# EAGLE design can_split (EAGLE 5.10)
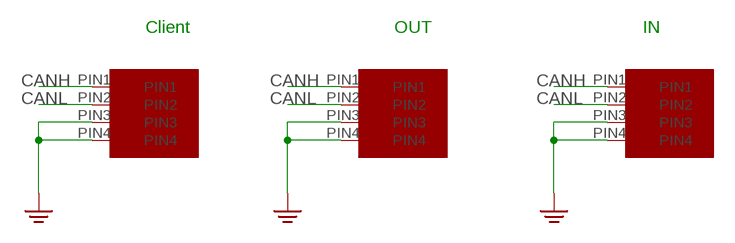
[diagram p0: schematic, sheet 1]

## Parts
U$1  MICROFIT4  [MICROFIT4SOCK]
U$3  MICROFIT4  [MICROFIT4SOCK]
U$4  MICROFIT4  [MICROFIT4SOCK]

## Nets
CANH: U$1.PIN1 U$3.PIN1 U$4.PIN1
CANL: U$1.PIN2 U$3.PIN2 U$4.PIN2
PE: U$1.PIN3 U$1.PIN4 U$3.PIN3 U$3.PIN4 U$4.PIN3 U$4.PIN4

## Notes on the sheet
- Client | OUT | IN

## Library data of the parts
U$1 U$3 U$4 = UNICORN:MICROFIT4

## Board
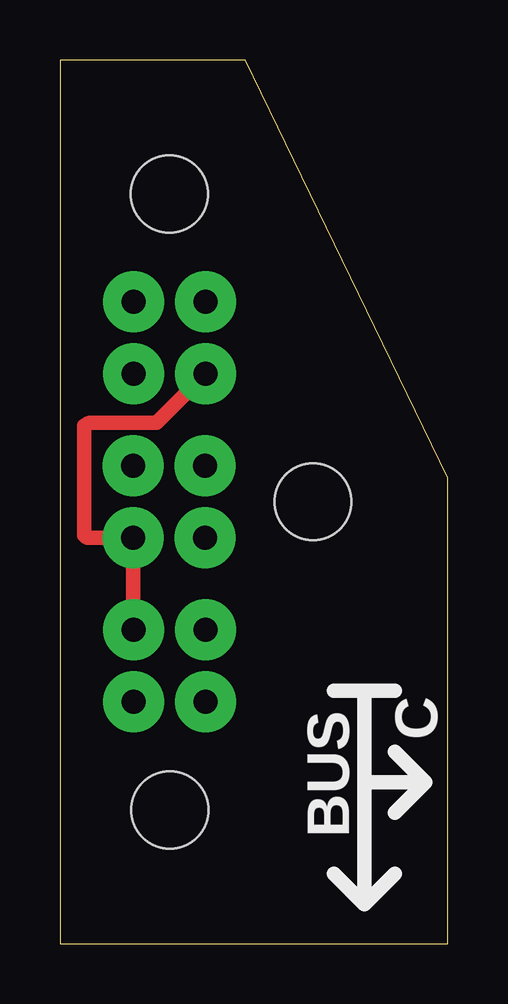
[diagram p1: board, top side]
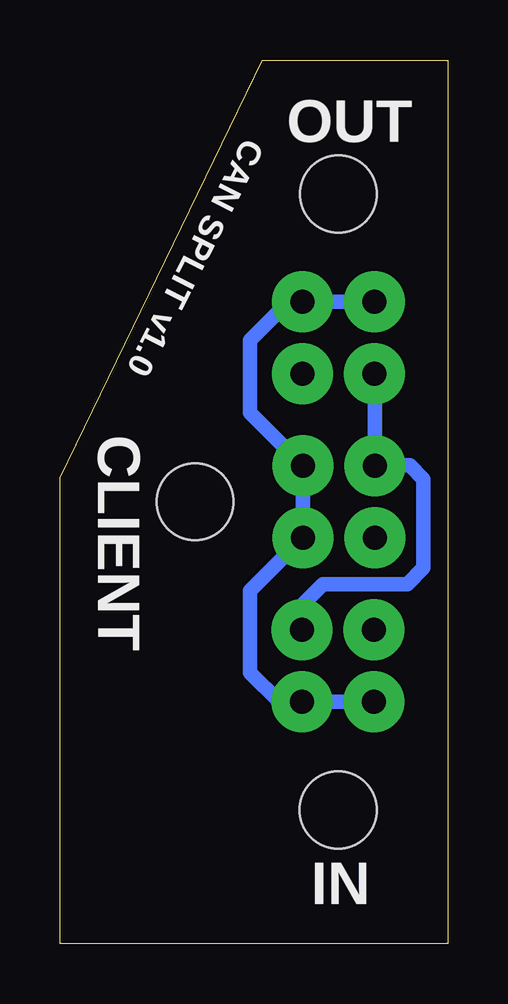
[diagram p2: board, bottom side, seen from below]

Size 16.18 x 36.83 mm. Coordinates in mm from the lower left corner, seen from the top.
Outline: 0,0 16.18,0 16.18,19.42 7.74,36.82 7.62,36.83 0,36.82 0,0
Copper layers (1*16): Top 0.035mm / dielectric 1.5mm / Bottom 0.035mm
Design rules "default": minimum track width 10mil, minimum drill 24mil, track to track 8mil, track to pad 8mil, pad to pad 8mil, via to via 8mil, smd to smd 8mil, copper to edge 40mil, drill to drill 8mil, minimum pad ring 10mil, minimum via ring 8mil, stop-mask expansion 4mil, vias tented up to drill 0mil, thermal gap 10mil

### Footprints (pad centres in the part's own frame; a part is rotated, then mirrored left to right if it is on the bottom)
MICROFIT4SOCK = drill 1 pad 2.54 round: PIN1 -2,0; PIN2 1,0; PIN3 -2,-3; PIN4 1,-3 | hole 3.2: -0.5,-7.5

### Placement (x,y rotation side)
U$1  5.08,13.08 0 top
U$3  4.06,23.75 180 top
U$4  3.05,18.92 90 top

### Tracks (layer width: path | path; a pad name or v marks a point on that pad's centre or on a via)
CANH
  Top 0.61: U$1.PIN1 3.05,13.11 U$4.PIN1 1.25,16.92 arc-45 1.02,17.02 1.02,21.59 arc-45 1.32,21.72 4.03,21.72 U$3.PIN1
CANL
  Bottom 0.61: U$3.PIN2 3.05,23.73 U$4.PIN2 3.03,19.94 1.58,19.94 1.02,19.37 1.02,15.67 1.7,14.99 5.21,14.99 6.08,14.11 U$1.PIN2
PE
  Bottom 0.61: U$1.PIN4 U$1.PIN3 7.03,10.08 8.26,11.3 8.26,14.72 U$4.PIN3 U$4.PIN4 8.26,22.13 8.26,25.15 6.65,26.75 U$3.PIN3 U$3.PIN4

### Text on the board
tPlace: C | BUS
bPlace: CAN SPLIT v1.0 | OUT | CLIENT | IN